# Altium schematic sheet VLC.SchDoc
size A4; SheetNumber: 1; SheetTotal: 6
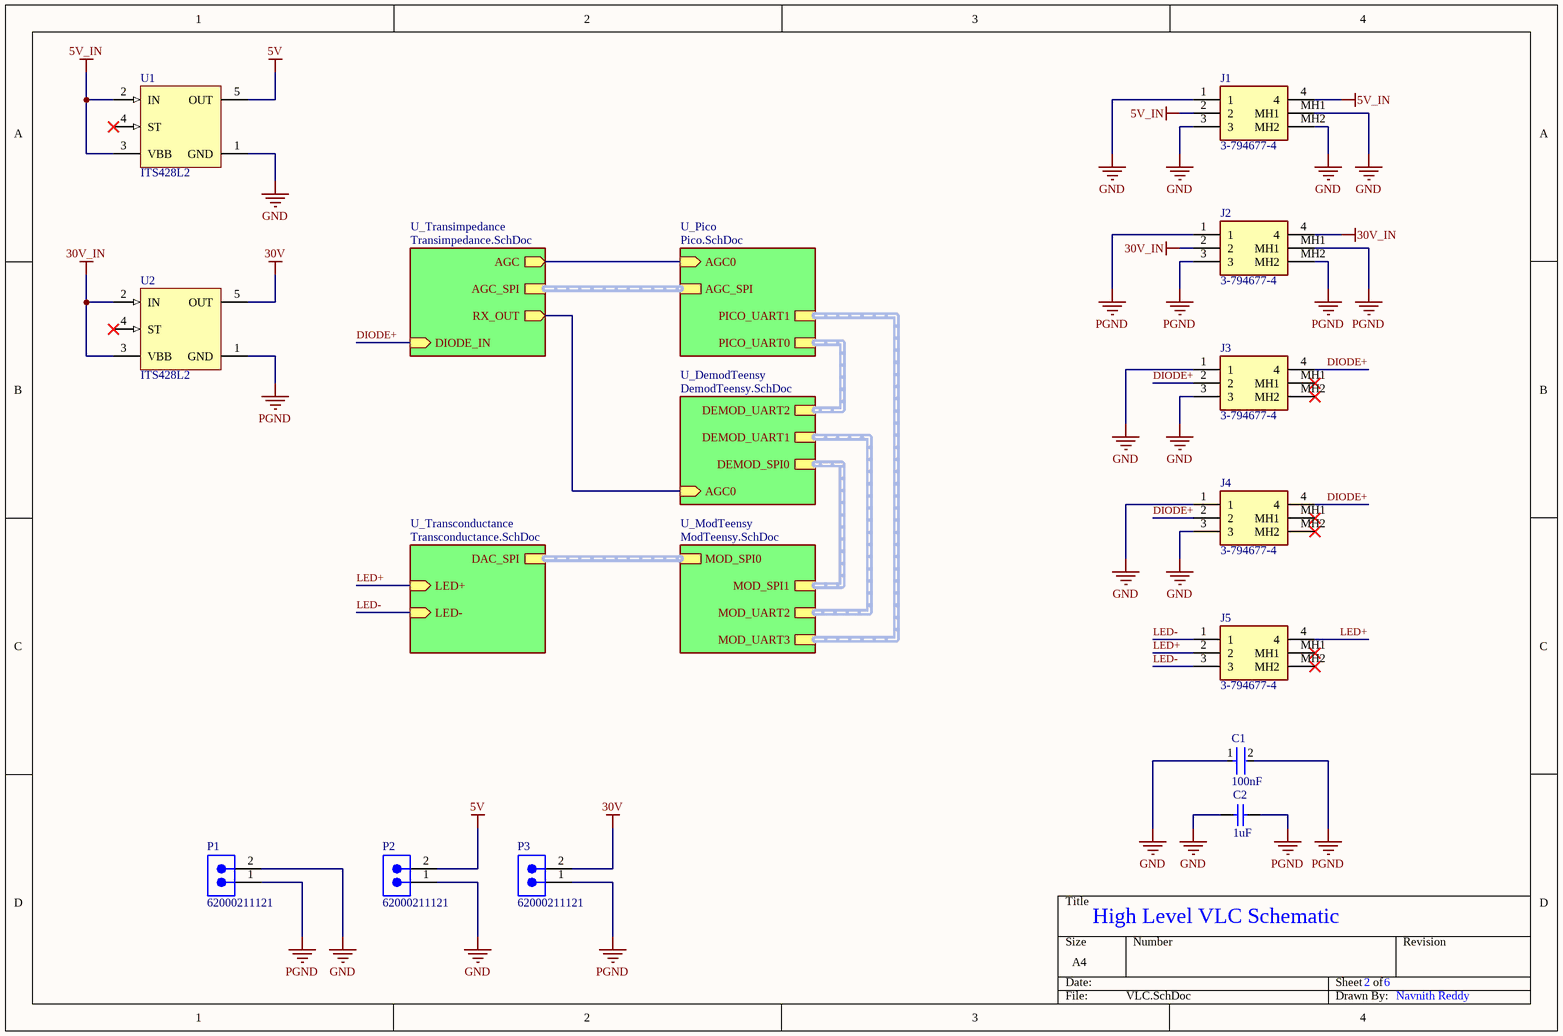
[diagram p0: VLC.SchDoc]

## Parts
C1  100nF  [FP-C0805C-DN-MFG]
C2  1uF  [CAPC2013X145X50LL20T25]
J1  3-794677-4  [37946774]
J2  3-794677-4  [37946774]
J3  3-794677-4  [37946774]
J4  3-794677-4  [37946774]
J5  3-794677-4  [37946774]
P1  62000211121  [62000211121]
P2  62000211121  [62000211121]
P3  62000211121  [62000211121]
U1  ITS428L2  [INF-PG-TO252-5-11_M]
U2  ITS428L2  [INF-PG-TO252-5-11_M]

## Sub-sheets
U_DemodTeensy = DemodTeensy.SchDoc: AGC0 (in), DEMOD_UART1 (harness M_UART2), DEMOD_UART2 (harness D_UART2), DEMOD_SPI0 (harness D_SPI0)
U_ModTeensy = ModTeensy.SchDoc: MOD_UART2 (harness M_UART2), MOD_UART3 (harness M_UART3), MOD_SPI0 (harness M_SPI0), MOD_SPI1 (harness M_SPI1)
U_Pico = Pico.SchDoc: AGC0 (in), PICO_UART1 (harness M_UART3), PICO_UART0 (harness D_UART2), AGC_SPI (harness PICO_SPI1)
U_Transconductance = Transconductance.SchDoc: LED+ (in), LED- (in), DAC_SPI (harness SPI)
U_Transimpedance = Transimpedance.SchDoc: AGC (out), DIODE_IN (in), AGC_SPI (harness SPI_0), RX_OUT (out)

## Nets
5V: P2.2 U1.5(OUT)
5V_IN: J1.2 J1.4 U1.2(IN) U1.3(VBB)
30V: P3.2 U2.5(OUT)
30V_IN: J2.2 J2.4 U2.2(IN) U2.3(VBB)
GND: C1.1 C2.2 J1.1 J1.3 J1.MH1 J1.MH2 J3.1 J3.3 J4.1 J4.3 P1.2 P2.1 U1.1(GND)
PGND: C1.2 C2.1 J2.1 J2.3 J2.MH1 J2.MH2 P1.1 P3.1 U2.1(GND)
DIODE+: J3.2 J3.4 J4.2 J4.4 ; sheet U_Transimpedance/DIODE_IN
LED+: J5.2 J5.4 ; sheet U_Transconductance/LED+
LED-: J5.1 J5.3 ; sheet U_Transconductance/LED-
(unnamed): sheet U_Pico/AGC0, sheet U_Transimpedance/AGC
(unnamed): sheet U_Transimpedance/RX_OUT, sheet U_DemodTeensy/AGC0

Not connected (* = marked no-connect by the designer): J3 MH1* MH2*; J4 MH1* MH2*; J5 MH1* MH2*; U1 4(ST)*; U2 4(ST)*

## Buses and harness runs
harness sheet U_DemodTeensy/DEMOD_SPI0 = sheet U_ModTeensy/MOD_SPI1
harness sheet U_DemodTeensy/DEMOD_UART1 = sheet U_ModTeensy/MOD_UART2
harness sheet U_DemodTeensy/DEMOD_UART2 = sheet U_Pico/PICO_UART0
harness sheet U_ModTeensy/MOD_SPI0 = sheet U_Transconductance/DAC_SPI
harness sheet U_ModTeensy/MOD_UART3 = sheet U_Pico/PICO_UART1
harness sheet U_Pico/AGC_SPI = sheet U_Transimpedance/AGC_SPI

## Notes on the sheet
- High Level VLC Schematic
- 2
- 6
- Navnith Reddy

## Library data of the parts
C1 = CMP-2007-00274-2: CAP CER 0.1UF 16V X7R 0805; Manufacturer Part Number: C0805C104K4RACTU; Manufacturer: KEMET; Material: Ceramic; Tolerance: 0.1; Capacitance: 0.10 μF; Value: 0.10 μF; Temperature Coefficient: 30ppm/°C; Device Class L3: Ceramic Capacitors; RoHS: TRUE; Octopart: https://octopart.com/c0805c104k4ractu-kemet-92155; ComponentLink2Description: Datasheet; ComponentLink2URL: https://content.kemet.com/datasheets/KEM_C1003_C0G_SMD.pdf; Temperature Range High: +125°C; Category: Cap; Lead Free: Yes; Digikey Description: CAP CER 0.1UF 16V X7R 0805; Automotive: No; Temperature Range Low: -55°C; Voltage Rating: 16 V; Package: C0805C-DN; Ipc Land Pattern Name: CAPC200125X78; Height: 0.88mm; Device Class L1: Passive Components; Temperature: -55°C to +125°C; Mouser Description: Multilayer Ceramic Capacitors MLCC - SMD/SMT 16volts 0.1uF X7R 10%; Device Class L2: Capacitors; Temperature Characteristic: X7R
C2 = CMP-1036-04746-2: Manufacturer: Kemet; Part Number: C0805C105K4PACTU
J1-J5 = 3-794677-4: Connector; Manufacturer_Name: TE Connectivity; Datasheet Link: https://www.te.com/commerce/DocumentDelivery/DDEController?Action=srchrtrv&DocNm=micro-mate-n-lok-connector-qrg&DocType=Data%20Sheet&DocLang=English&PartCntxt=3-794677-4&DocFormat=pdf; Height: 8.67mm; Manufacturer_Part_Number: 3-794677-4; Mouser Part Number: 571-3-794677-4; Mouser Price/Stock: https://www.mouser.co.uk/ProductDetail/TE-Connectivity-AMP/3-794677-4?qs=6xDM53S3Z3IXPJK6%252BrOgPw%3D%3D; Arrow Part Number: 3-794677-4; Arrow Price/Stock: https://www.arrow.com/en/products/3-794677-4/te-connectivity?region=europe
P1-P3 = CMP-1502-00956-3: NexarPartId: 61924778; Number of Contacts: 2; Voltage Rating: 200V; Gender: Male; Contact Resistance: 20mΩ; Current Rating: 2A; Lead Pitch: 2mm; Max Operating Temperature: 105°C; Contact Material: Gold; Number of Rows: 1; Operating Supply Voltage: 200V; Number of Pins: 2; Orientation: Vertical; Min Operating Temperature: -40°C; Height: 6.35mm; RoHS: Non-Compliant
U1 U2 = CMP-1095-00118-1: Smart High-Side Power Switch for Industrial Applications 1 Channel: 60 mOhm Status Feedback, 4.75 to 41 V Operating, -30 to 85 degC, PG-TO252-5-11, Reel, Green; Manufacturer: Infineon; IL (nom)min - one channel active: 5.8Â A; Ptot (max): 75 W; toff (max): 200 us; Green: TRUE; RON @ 25 degC: 60 mOhm (max); Channels: 1; RON (max) @ Tj max: 120 mOhm; Operating Voltage Range (min): 4.75Â V; IL (SC): 22 A; Operating Voltage Range (max): 41 V; Diagnostic: Digital; ComponentLink2Description: Datasheet; PackageVersion: Nov-10; PartNumber: ITS428L2; PackageDescription: 5-Pin Plastic (Green) Transistor Single Outline Package, 6.5 x 6.12 mm Body, 1.14 mm Pitch; ComponentLink2URL: http://www.infineon.com/dgdl/ITS428L2_DS11_20081010.pdf?folderId=db3a304314dca389011537739e37155f&fileId=db3a30431c69a49d011cdcc9a1fd41df; DatasheetVersion: Rev. 1.1; IL (nom)min - all channels active: 5.8Â A; PackageReference: PG-TO252-5-11; ton (max): 200 us; Mounting Technology: Surface Mount; ComponentLink3Description: Package Specification; Load Current (typ): 5.8Â A; Packing: Reel; Halogen-free: TRUE; ComponentLink1Description: Manufacturer URL; ComponentLink1URL: http://www.infineon.com/; ComponentLink3URL: http://www.infineon.com/dgdl/TLE7276-Data+Sheet-+v1_11.pdf?folderId=db3a304412b407950112b408e8c90004&fileId=db3a304412b407950112b436c53f66c8&sId=db3a30433db6f09f013dc0e43c0428c1; IL (SCp): 22 A